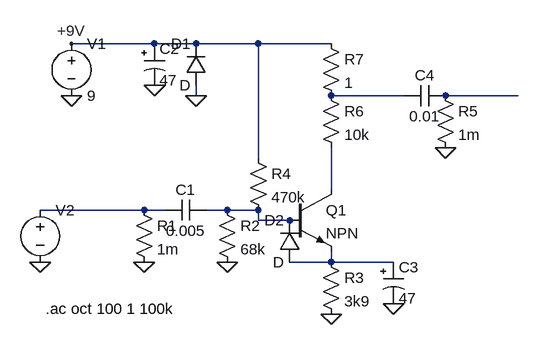
[diagram p0: schematic Rangemaster.asc]
Rangemaster.asc, the LTspice schematic file:
Version 4
SHEET 1 880 680
WIRE 16 144 -112 144
WIRE 80 144 16 144
WIRE 176 144 80 144
WIRE 288 144 176 144
WIRE 80 224 80 208
WIRE 400 224 288 224
WIRE 576 224 464 224
WIRE 176 320 176 144
WIRE 288 368 288 304
WIRE 0 400 -160 400
WIRE 32 400 0 400
WIRE 128 400 96 400
WIRE 176 400 128 400
WIRE 176 416 176 400
WIRE 224 416 176 416
WIRE 288 480 288 464
WIRE 288 480 224 480
WIRE 384 480 288 480
FLAG -112 224 0
FLAG -160 480 0
FLAG -112 144 +9V
FLAG 16 208 0
FLAG 80 224 0
FLAG 0 480 0
FLAG 128 480 0
FLAG 288 560 0
FLAG 384 544 0
FLAG 464 304 0
SYMBOL voltage -112 128 R0
SYMATTR InstName V1
SYMATTR Value 9
SYMBOL voltage -160 384 R0
SYMATTR InstName V2
SYMATTR Value ""
SYMATTR Value2 AC 1
SYMBOL res -16 384 R0
SYMATTR InstName R1
SYMATTR Value 1m
SYMBOL res 112 384 R0
SYMATTR InstName R2
SYMATTR Value 68k
SYMBOL res 272 464 R0
SYMATTR InstName R3
SYMATTR Value 3k9
SYMBOL cap 96 384 R90
WINDOW 0 0 32 VBottom 2
WINDOW 3 32 32 VTop 2
SYMATTR InstName C1
SYMATTR Value 0.005
SYMBOL diode 96 208 R180
WINDOW 0 24 64 Left 2
WINDOW 3 24 0 Left 2
SYMATTR InstName D1
SYMBOL diode 240 480 R180
WINDOW 0 24 64 Left 2
WINDOW 3 24 0 Left 2
SYMATTR InstName D2
SYMBOL npn 224 368 R0
SYMATTR InstName Q1
SYMBOL res 160 304 R0
SYMATTR InstName R4
SYMATTR Value 470k
SYMBOL res 272 208 R0
SYMATTR InstName R6
SYMATTR Value 10k
SYMBOL res 272 128 R0
SYMATTR InstName R7
SYMATTR Value 1
SYMBOL cap 464 208 R90
WINDOW 0 0 32 VBottom 2
WINDOW 3 32 32 VTop 2
SYMATTR InstName C4
SYMATTR Value 0.01
SYMBOL res 448 208 R0
SYMATTR InstName R5
SYMATTR Value 1m
SYMBOL polcap 0 144 R0
SYMATTR InstName C2
SYMATTR Value 47
SYMBOL polcap 368 480 R0
SYMATTR InstName C3
SYMATTR Value 47
TEXT -152 552 Left 2 !.ac oct 100 1 100k

The netlist it stands for:
* Rangemaster.asc
V1 +9V 0 9
V2 N004 0 AC 1
R1 N004 0 1m
R2 N005 0 68k
R3 N006 0 3k9
C1 N005 N004 0.005
D1 0 +9V D
D2 N006 N005 D
Q1 N003 N005 N006 0 NPN
R4 +9V N005 470k
R6 N001 N003 10k
R7 +9V N001 1
C4 N002 N001 0.01
R5 N002 0 1m
C2 +9V 0 47
C3 N006 0 47
.model D D
.lib standard.dio
.model NPN NPN
.model PNP PNP
.lib standard.bjt
.ac oct 100 1 100k
.backanno
.end